# EAGLE design KIS-3R33 (EAGLE 6.5.0)
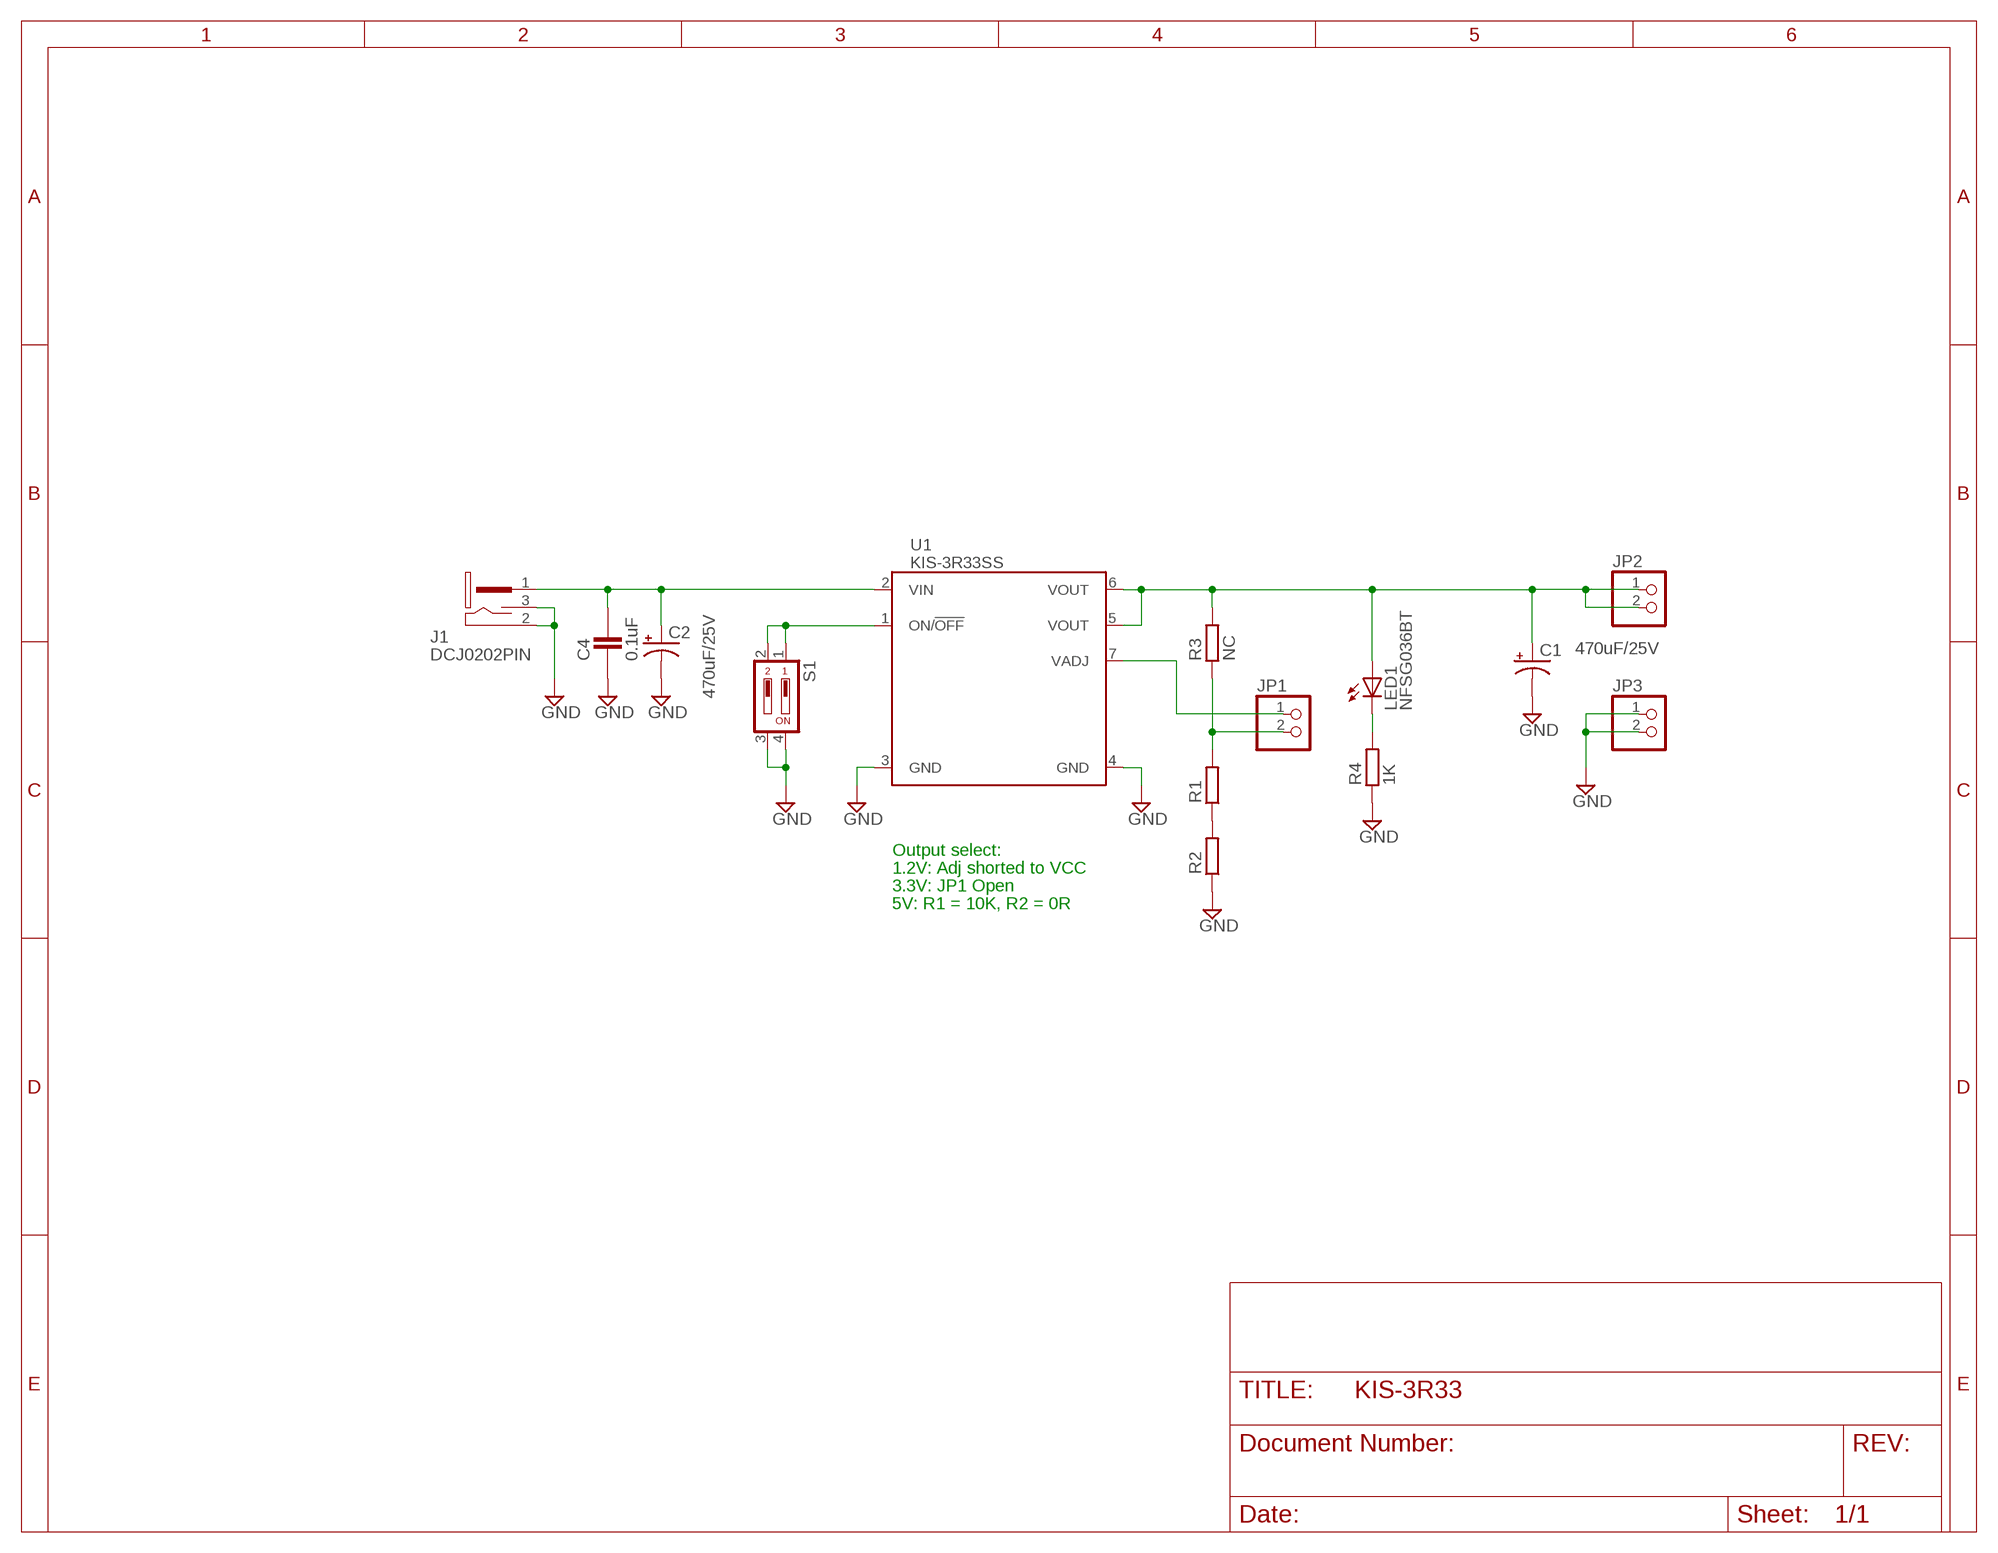
[diagram p0: schematic, sheet 1]

## Parts
C1  470uF/25V  CAP_POLG  [PANASONIC_G]
C2  470uF/25V  CAP_POLG  [PANASONIC_G]
C4  0.1uF  CAPACITOR_0805N  [CAP2012X70N]
J1  DCJ0202PIN  [PJ-102A]
JP1  PINHD-1X2_2.54-SMD  [1X02SMD]
JP2  PINHD-1X2_2.54  [1X02]
JP3  PINHD-1X2_2.54  [1X02]
LED1  NFSG036BT  [NFSG036BT]
R1  RESISTOR_1206  [RESC3115X70N]
R2  RESISTOR_1206  [RESC3115X70N]
R3  NC  RESISTOR_1206  [RESC3115X70N]
R4  1K  RESISTOR_0603  [RESC1608X55N]
S1  DIP02YL  [DIP02YL]
U1  KIS-3R33SS  [KIS-3R33S-SMT]

## Nets
GND: C1.- C2.- C4.1 J1.2 J1.3 JP3.1 JP3.2 R2.1 R4.1 S1.3 S1.4 U1.3(GND) U1.4(GND)
N$1: C1.+ JP2.1 JP2.2 LED1.A R3.2 U1.5(VOUT) U1.6(VOUT)
N$2: C2.+ C4.2 J1.1 U1.2(VIN)
N$3: JP1.1 U1.7(VADJ)
N$4: R1.1 R2.2
N$5: JP1.2 R1.2 R3.1
N$6: LED1.C R4.2
N$7: S1.1 S1.2 U1.1(ON/!OFF)

## Notes on the sheet
- Output select:
- 1.2V: Adj shorted to VCC
- 3.3V: JP1 Open
- 5V: R1 = 10K, R2 = 0R

## Library data of the parts
C1 C2 = Misc Passives:CAP_POL: Capacitor Polarized These are standard SMD and PTH capacitors. Normally 10uF, 47uF, and 100uF in electrolytic and tantalum varieties. Always verify the external diameter of the through hole cap, it varies with capacity, voltage, and manufacturer. The EIA devices should be standard.
C4 = ipc-7351-capacitor:CAPACITOR_
J1 = Misc Conn:DCJ0202: DC POWER JACK Source: DCJ0202.pdf Pin = CUI Inc. PJ-102A with formed pins
JP1-JP3 = pinhead-1:PINHD-1X2: PIN HEADER
LED1 = Misc opto:NFSG036BT: CHIP TYPE GREEN LED NFSx036xT Source: NICHIA CORPORATION .. NFSG036BT-E.pdf
R1-R4 = ipc-7351-resistor:RESISTOR_
S1 = switch-dil:DIP02YL: DIL/CODE SWITCH; OC_FARNELL: unknown; OC_NEWARK: unknown
U1 = Misc Power:KIS-3R33S: M2307 Adjustable Sync Buck Power Supply Module

## Board
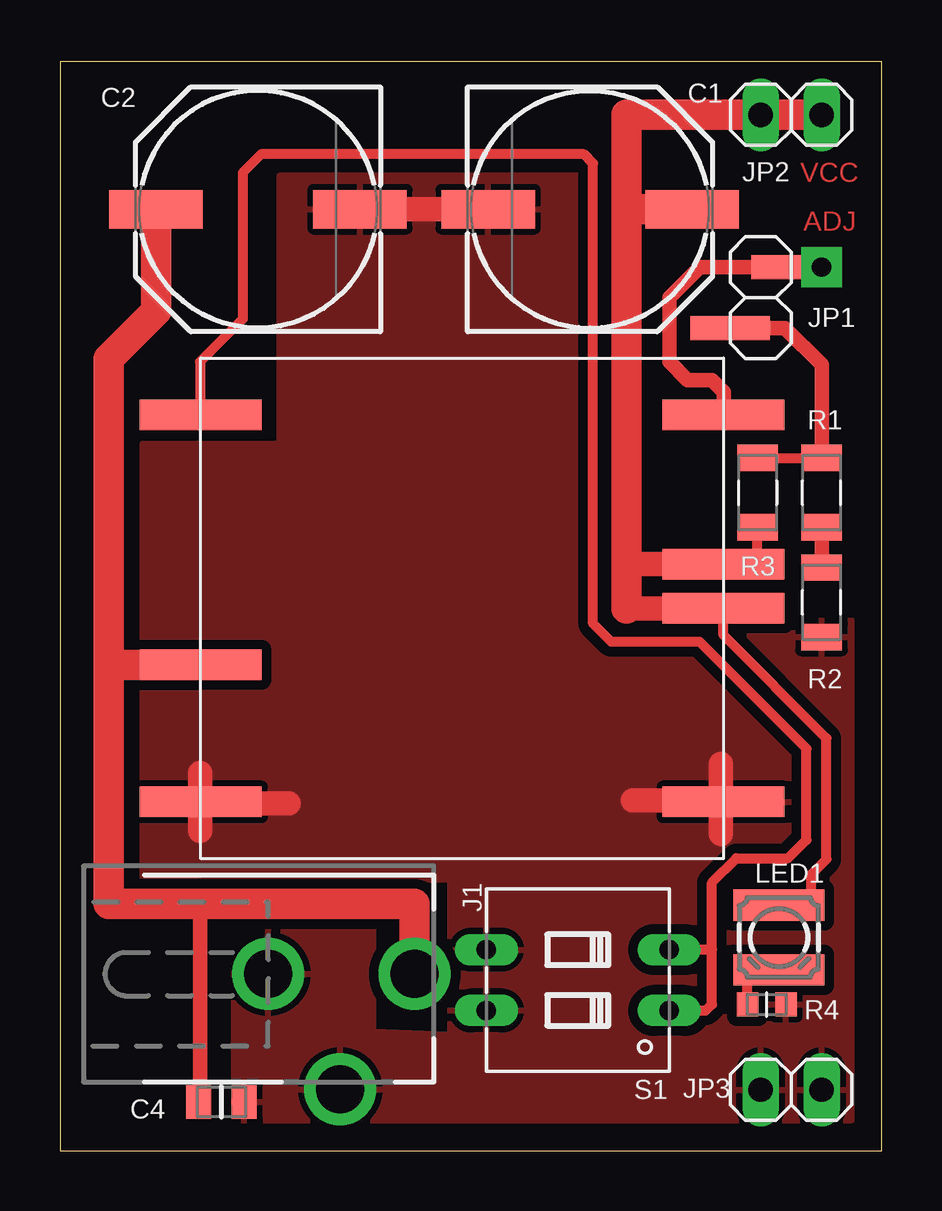
[diagram p1: board, top side]

Size 34.27 x 45.39 mm. Coordinates in mm from the lower left corner, seen from the top.
Outline: 0,0 34.27,0 34.27,45.39 0,45.39 0,0
Copper layers (1*16): Top 0.035mm / dielectric 1.5mm / Bottom 0.035mm
Design rules "default": minimum track width 10mil, minimum drill 24mil, track to track 8mil, track to pad 8mil, pad to pad 8mil, via to via 8mil, smd to smd 8mil, copper to edge 40mil, drill to drill 8mil, minimum pad ring 10mil, minimum via ring 8mil, stop-mask expansion 4mil, vias tented up to drill 0mil, thermal gap 10mil

### Footprints (pad centres in the part's own frame; a part is rotated, then mirrored left to right if it is on the bottom)
PANASONIC_G = smd 3.9 x 1.6: + 4.25,0; - -4.25,0
CAP2012X70N = smd 1.05 x 1.4: 1 -0.95,0; 2 0.95,0
PJ-102A = drill 2: 1 0,3.1; 2 0,-3; 3 4.8,0
1X02SMD = smd 1.016 x 3.302: 1 -1.27,1.27; 2 1.27,-1.27
1X02 = drill 1.016 long: 1 -1.27,0; 2 1.27,0
NFSG036BT = smd 1.3 x 3.8: A 1.35,0; C -1.35,0
RESC3115X70N = smd 1.1 x 1.7: 1 -1.45,0; 2 1.45,0
RESC1608X55N = smd 0.9 x 1: 1 -0.8,0; 2 0.8,0
DIP02YL = drill 0.813 long: 1 -1.27,-3.81; 2 1.27,-3.81; 3 1.27,3.81; 4 -1.27,3.81
KIS-3R33S-SMT = smd 5.08 x 1.27: 1 -10.897,8.065; 2 -10.897,-2.349; 3 -10.897,-8.065; 4 10.897,-8.065; 5 10.897,0; 6 10.897,1.841; 7 10.897,8.065

### Placement (x,y rotation side)
C1  22.1,39.24 0 top
C2  8.25,39.24 180 top
C4  6.73,2.03 180 top
J1  11.68,7.37 270 top
JP1  29.21,35.56 270 top
JP2  30.48,43.18 180 top
JP3  30.48,2.54 0 top
LED1  29.97,8.89 90 top
R1  31.75,27.43 90 top
R2  31.75,22.86 90 top
R3  29.08,27.43 270 top
R4  29.46,6.1 180 top
S1  21.59,7.11 90 top
U1  16.76,22.61 0 top

### Tracks (layer width: path | path; a pad name or v marks a point on that pad's centre or on a via)
GND
  Top 1.016: 4.32,14.6 4.7,14.48 5.8,14.48 U1.3 | C2.- C1.- | 27.56,13.21 27.56,16.13 | 23.88,14.6 27.18,14.6 | 5.84,14.6 5.84,15.75 | 9.52,14.48 5.84,14.48 5.84,13.34
  pour Top (isolate 0.406): 9.14,40.64 9.14,29.46 3.43,29.46 3.43,11.3 16.26,11.3 16.26,4.83 13.08,4.95 13.08,9.27 7.24,9.14 7.24,1.27 33.02,1.27 33.02,22.1 22.48,21.97 22.35,40.64
N$1
  Top 0.406: R3.2 29.08,24.26 29.21,24.13 27.98,24.13 U1.6 | LED1.A 30.99,10.16 31.32,10.37 31.32,11.51 31.96,12.15 31.96,17.19 27.66,21.49 U1.5
  Top 1.016: U1.6 23.69,24.45 23.62,24.51 | 23.62,22.61 U1.5 29.34,22.61
  Top 1.27: 23.62,22.61 23.62,24.51 23.62,39.37 | JP2.1 JP2.2 23.75,43.18 | 23.75,43.18 23.62,43.18 | 23.62,39.37 23.62,43.05 23.75,43.18 | C1.+ 23.75,39.24 23.62,39.37
N$2
  Top 0.61: C4.2 5.84,2.03 5.84,10.29
  Top 1.27: C2.+ 4,34.99 2.03,33.02 2.03,20.19 | 2.03,20.19 2.03,10.29 5.84,10.29 14.78,10.29 J1.1 | U1.2 2.1,20.26 2.03,20.19
N$3  (via drill 0.8 pad 1.68)
  Top 0.406: U1.7 27.69,30.65
  Top 0.61: 27.69,30.7 27.69,31.62 27.18,32.13 26.16,32.13 25.4,32.89 25.4,35.56 26.67,36.83 JP1.1 v31.75,36.83
  Top 1.016: 27.69,30.7 U1.7
N$4
  Top 0.61: R2.2 R1.1
N$5
  Top 0.406: R1.2 31.75,28.83 31.7,28.88 R3.1
  Top 0.61: JP1.2 30.23,34.29 31.75,32.77 R1.2
N$6
  Top 0.406: R4.2 28.66,7.45 28.7,7.49 29.92,7.49 LED1.C
N$7
  Top 0.406: S1.1 26.92,5.84 27.18,6.1 27.18,8.38 | 27.18,8.38 27.18,11.18 28.19,12.19 30.35,12.19 31.12,12.95 31.12,16.76 26.67,21.21 22.99,21.21 22.22,21.97 22.22,41.15 21.84,41.53 8.38,41.53 7.62,40.77 7.62,34.67 5.84,32.89 5.84,30.7 U1.1 | 27.18,8.38 S1.2

### Text on the board
Top: VCC | ADJ